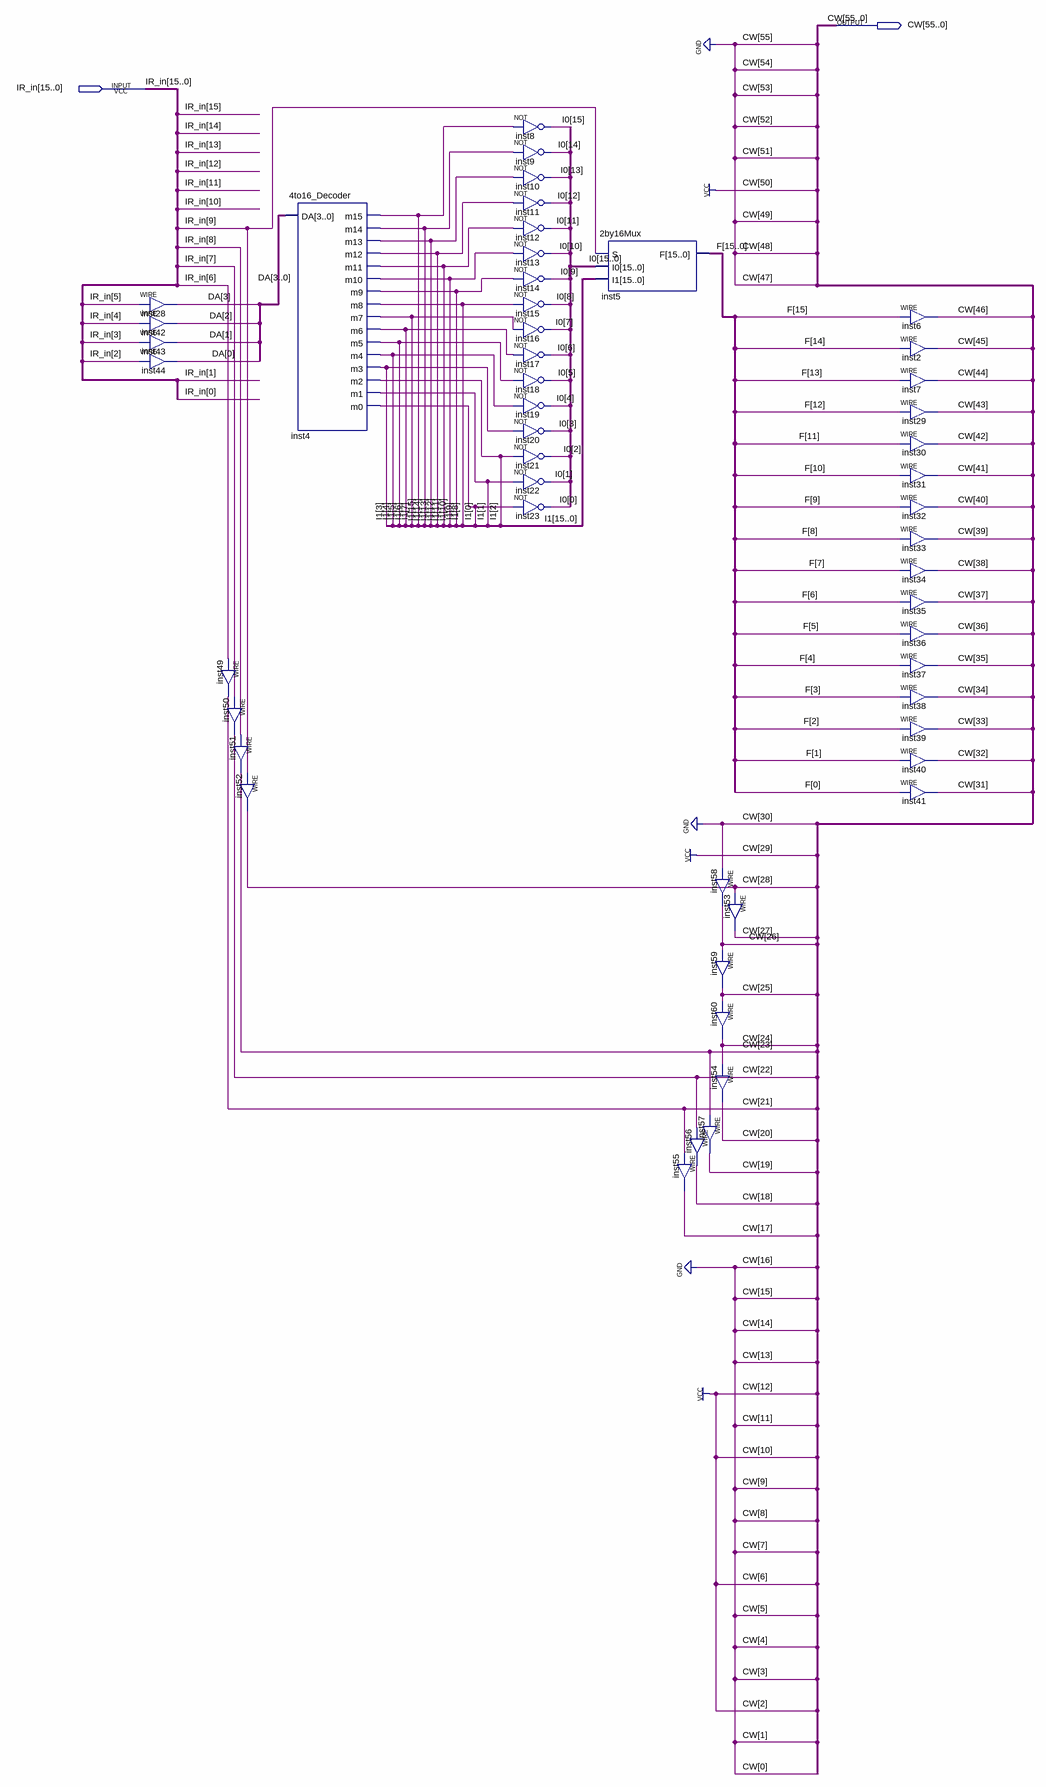
[diagram p0: schematic sheet]
// Quartus schematic Execute0_10_Bitwise.bdf as structural Verilog: 50 symbols, 2 pins
module Execute0_10_Bitwise (
  input  [15:0] IR_in,
  output [55:0] CW
);

  wire [3:0] DA;
  wire [15:0] F, I0, I1;

  assign DA[3] = IR_in[5];  // WIRE inst28
  assign DA[2] = IR_in[4];  // WIRE inst42
  assign DA[1] = IR_in[3];  // WIRE inst43
  assign DA[0] = IR_in[2];  // WIRE inst44
  assign CW[21] = IR_in[6];  // WIRE inst49
  assign CW[22] = IR_in[7];  // WIRE inst50
  assign CW[23] = IR_in[8];  // WIRE inst51
  assign CW[28] = IR_in[9];  // WIRE inst52
  \4to16_Decoder  inst4 (
    .DA(DA), .m15(I1[15]), .m14(I1[14]), .m13(I1[13]), .m12(I1[12]), .m11(I1[11]), .m10(I1[10]), .m9(I1[9]),
    .m8(I1[8]), .m7(I1[7]), .m6(I1[6]), .m5(I1[5]), .m4(I1[4]), .m3(I1[3]), .m2(I1[2]), .m1(I1[1]), .m0(I1[0]));
  not inst8 (I0[15], I1[15]);
  not inst9 (I0[14], I1[14]);
  not inst10 (I0[13], I1[13]);
  not inst11 (I0[12], I1[12]);
  not inst12 (I0[11], I1[11]);
  not inst13 (I0[10], I1[10]);
  not inst14 (I0[9], I1[9]);
  not inst15 (I0[8], I1[8]);
  not inst16 (I0[7], I1[7]);
  not inst17 (I0[6], I1[6]);
  not inst18 (I0[5], I1[5]);
  not inst19 (I0[4], I1[4]);
  not inst20 (I0[3], I1[3]);
  not inst21 (I0[2], I1[2]);
  not inst22 (I0[1], I1[1]);
  not inst23 (I0[0], I1[0]);
  \2by16Mux  inst5 (.S(IR_in[9]), .I0(I0), .I1(I1), .F(F));
  assign CW[19] = CW[23];  // WIRE inst57
  assign CW[18] = CW[22];  // WIRE inst56
  assign CW[17] = CW[21];  // WIRE inst55
  assign CW[26] = 1'b0;  // WIRE inst58
  assign CW[27] = CW[28];  // WIRE inst53
  assign CW[25] = CW[26];  // WIRE inst59
  assign CW[24] = CW[25];  // WIRE inst60
  assign CW[20] = CW[24];  // WIRE inst54
  assign CW[46] = F[15];  // WIRE inst6
  assign CW[45] = F[14];  // WIRE inst2
  assign CW[44] = F[13];  // WIRE inst7
  assign CW[43] = F[12];  // WIRE inst29
  assign CW[42] = F[11];  // WIRE inst30
  assign CW[41] = F[10];  // WIRE inst31
  assign CW[40] = F[9];  // WIRE inst32
  assign CW[39] = F[8];  // WIRE inst33
  assign CW[38] = F[7];  // WIRE inst34
  assign CW[37] = F[6];  // WIRE inst35
  assign CW[36] = F[5];  // WIRE inst36
  assign CW[35] = F[4];  // WIRE inst37
  assign CW[34] = F[3];  // WIRE inst38
  assign CW[33] = F[2];  // WIRE inst39
  assign CW[32] = F[1];  // WIRE inst40
  assign CW[31] = F[0];  // WIRE inst41

  assign {CW[55:47], CW[30:29], CW[16:0]} = 28'b0000010000100001010001000100;
endmodule
